# EAGLE schematic eagle_export_sch (EAGLE 7.5.0)

## Sheet 1 of 4
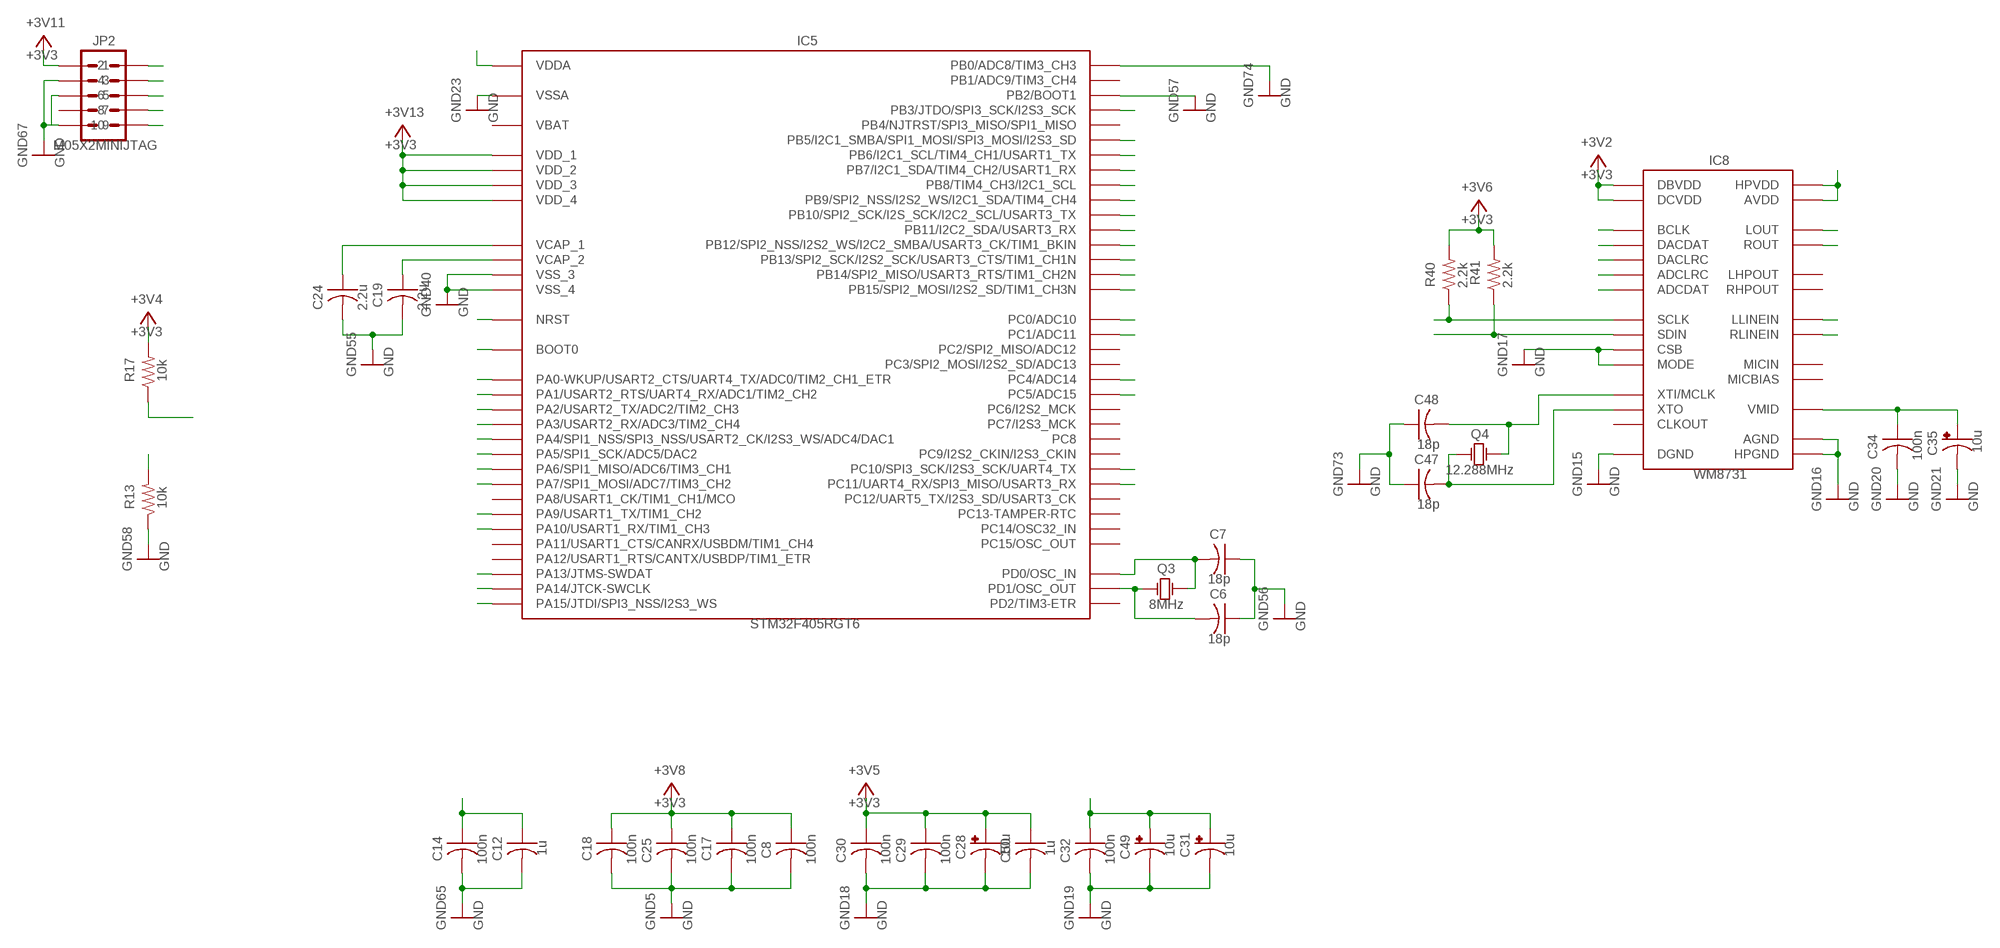
[diagram p0: schematic, sheet 1]

### Parts
C6  18p  C-USC0603_2  [CAP_0603]
C7  18p  C-USC0603_2  [CAP_0603]
C8  100n  C-USC0603  [CAP_0603]
C12  1u  C-USC0603  [CAP_0603]
C14  100n  C-USC0603  [CAP_0603]
C17  100n  C-USC0603  [CAP_0603]
C18  100n  C-USC0603  [CAP_0603]
C19  2.2u  C-USC0805  [CAP_0805]
C24  2.2u  C-USC0805  [CAP_0805]
C25  100n  C-USC0603  [CAP_0603]
C28  10u  CPOL-USA  [PANASONIC_A]
C29  100n  C-USC0603  [CAP_0603]
C30  100n  C-USC0603  [CAP_0603]
C31  10u  CPOL-USB  [PANASONIC_B]
C32  100n  C-USC0603  [CAP_0603]
C34  100n  C-USC0603  [CAP_0603]
C35  10u  CPOL-USB  [PANASONIC_B]
C47  18p  C-USC0603_3  [CAP_0603]
C48  18p  C-USC0603_3  [CAP_0603]
C49  10u  CPOL-USA  [PANASONIC_A]
C50  1u  C-USC0603  [CAP_0603]
IC5  STM32F405RGT6  STM32F20X  [TQFP-10X10-64]
IC8  WM8731  [SSOP28]
JP2  M05X2MINIJTAG  [2X5-1.27]
Q3  8MHz  TXC_7A_CRYSTAL  [TSC_7A_crystal]
Q4  12.288MHz  TXC_7A_CRYSTAL  [TSC_7A_crystal]
R13  10k  R-US_R0603_26  [RES_0603]
R17  10k  R-US_R0603_27  [RES_0603]
R40  2.2k  R-US_R0603_27  [RES_0603]
R41  2.2k  R-US_R0603_27  [RES_0603]

### Nets
+3V3: C8.1 C17.1 C18.1 C25.1 C28.+ C29.1 C30.1 C50.1 IC5.19(VDD_4) IC5.32(VDD_1) IC5.48(VDD_2) IC5.64(VDD_3) IC8.1(DBVDD) IC8.27(DCVDD) JP2.1 R17.2 R40.2 R41.2 ; also sheet 3,4
+3V3_A: C12.1 C14.1 C31.+ C32.1 C49.+ IC5.13(VDDA) IC8.8(HPVDD) IC8.14(AVDD) ; also sheet 2,3,4
Blend2: IC5.10(PC2/SPI2_MISO/ADC12) ; also sheet 2
Blend3: IC5.11(PC3/SPI2_MOSI/I2S2_SD/ADC13) ; also sheet 2
Blend4: IC5.27(PB1/ADC9/TIM3_CH4) ; also sheet 2
BLEND_CV: IC5.21(PA5/SPI1_SCK/ADC5/DAC2) ; also sheet 2
BLEND_POT: IC5.23(PA7/SPI1_MOSI/ADC7/TIM3_CH2) ; also sheet 3
BOOT_FLASH: IC5.60(BOOT0) R13.2
DENSITY_CV: IC5.17(PA3/USART2_RX/ADC3/TIM2_CH4) ; also sheet 2
GND: C6.1 C7.1 C8.2 C12.2 C14.2 C17.2 C18.2 C19.2 C24.2 C25.2 C28.- C29.2 C30.2 C31.- C32.2 C34.2 C35.- C47.1 C48.1 C49.- C50.2 IC5.12(VSSA) IC5.18(VSS_4) IC5.26(PB0/ADC8/TIM3_CH3) IC5.28(PB2/BOOT1) IC5.63(VSS_3) IC8.11(HPGND) IC8.15(AGND) IC8.21(MODE) IC8.22(CSB) IC8.28(DGND) JP2.3 JP2.5 JP2.9 R13.1 ; also sheet 2,3,4
I2C_SCL: IC5.29(PB10/SPI2_SCK/I2S_SCK/I2C2_SCL/USART3_TX) IC8.24(SCLK) R40.1
I2C_SDA: IC5.30(PB11/I2C2_SDA/USART3_RX) IC8.23(SDIN) R41.1
I2S_LRCK: IC5.33(PB12/SPI2_NSS/I2S2_WS/I2C2_SMBA/USART3_CK/TIM1_BKIN) IC8.5(DACLRC) IC8.7(ADCLRC)
I2S_SCK: IC5.34(PB13/SPI2_SCK/I2S2_SCK/USART3_CTS/TIM1_CH1N) IC8.3(BCLK)
I2S_SIN: IC5.35(PB14/SPI2_MISO/USART3_RTS/TIM1_CH2N) IC8.6(ADCDAT)
I2S_SOUT: IC5.36(PB15/SPI2_MOSI/I2S2_SD/TIM1_CH3N) IC8.4(DACDAT)
JTCK: IC5.49(PA14/JTCK-SWCLK) JP2.4
JTDI: IC5.50(PA15/JTDI/SPI3_NSS/I2S3_WS) JP2.8
JTDO: IC5.55(PB3/JTDO/SPI3_SCK/I2S3_SCK) JP2.6
JTMS: IC5.46(PA13/JTMS-SWDAT) JP2.2
LED_DATA: IC5.57(PB5/I2C1_SMBA/SPI1_MOSI/SPI3_MOSI/I2S3_SD) ; also sheet 3
LED_EN: IC5.24(PC4/ADC14) ; also sheet 3
LED_REC: IC5.62(PB9/SPI2_NSS/I2S2_WS/I2C1_SDA/TIM4_CH4) ; also sheet 3
LED_SCK: IC5.25(PC5/ADC15) ; also sheet 3
LIN: IC8.20(LLINEIN) ; also sheet 2
LOUT: IC8.12(LOUT) ; also sheet 2
N$7: C7.2 IC5.5(PD0/OSC_IN) Q3.2(OSC2)
N$8: C6.2 IC5.6(PD1/OSC_OUT) Q3.1(OSC1)
N$13: C19.1 IC5.47(VCAP_2)
N$17: C34.1 C35.+ IC8.16(VMID)
N$19: C24.1 IC5.31(VCAP_1)
N$59: C47.2 IC8.26(XTO) Q4.1(OSC1)
N$60: C48.2 IC8.25(XTI/MCLK) Q4.2(OSC2)
PITCH_POT: IC5.9(PC1/ADC11) ; also sheet 3
PLAY: IC5.58(PB6/I2C1_SCL/TIM4_CH1/USART1_TX) ; also sheet 3
POSITION_POT_CV: IC5.16(PA2/USART2_TX/ADC2/TIM2_CH3) ; also sheet 2
REC: IC5.59(PB7/I2C1_SDA/TIM4_CH2/USART1_RX) ; also sheet 3
RESET: IC5.7(NRST) JP2.10 R17.1
RIN: IC8.19(RLINEIN) ; also sheet 2
ROUT: IC8.13(ROUT) ; also sheet 2
RX: IC5.43(PA10/USART1_RX/TIM1_CH3)
SIZE_CV: IC5.15(PA1/USART2_RTS/UART4_RX/ADC1/TIM2_CH2) ; also sheet 2
SIZE_POT: IC5.8(PC0/ADC10) ; also sheet 3
SW_LOAD: IC5.51(PC10/SPI3_SCK/I2S3_SCK/UART4_TX) ; also sheet 3
SW_MODE: IC5.52(PC11/UART4_RX/SPI3_MISO/USART3_RX) ; also sheet 3
SW_REC: IC5.61(PB8/TIM4_CH3/I2C1_SCL) ; also sheet 3
TEXTURE_CV: IC5.14(PA0-WKUP/USART2_CTS/UART4_TX/ADC0/TIM2_CH1_ETR) ; also sheet 2
TEXTURE_POT: IC5.22(PA6/SPI1_MISO/ADC6/TIM3_CH1) ; also sheet 3
TX: IC5.42(PA9/USART1_TX/TIM1_CH2)
V_OCT: IC5.20(PA4/SPI1_NSS/SPI3_NSS/USART2_CK/I2S3_WS/ADC4/DAC1) ; also sheet 2
Unconnected: IC5.2(PC13-TAMPER-RTC) IC5.3(PC14/OSC32_IN) IC5.4(PC15/OSC_OUT) IC5.37(PC6/I2S2_MCK) IC5.38(PC7/I2S3_MCK) IC5.39(PC8) IC5.40(PC9/I2S2_CKIN/I2S3_CKIN) IC5.41(PA8/USART1_CK/TIM1_CH1/MCO) IC5.44(PA11/USART1_CTS/CANRX/USBDM/TIM1_CH4) IC5.45(PA12/USART1_RTS/CANTX/USBDP/TIM1_ETR) IC5.53(PC12/UART5_TX/I2S3_SD/USART3_CK) IC5.54(PD2/TIM3-ETR) IC5.56(PB4/NJTRST/SPI3_MISO/SPI1_MISO) IC8.2(CLKOUT) IC8.9(LHPOUT) IC8.10(RHPOUT) IC8.17(MICBIAS) IC8.18(MICIN) JP2.7

## Sheet 2 of 4
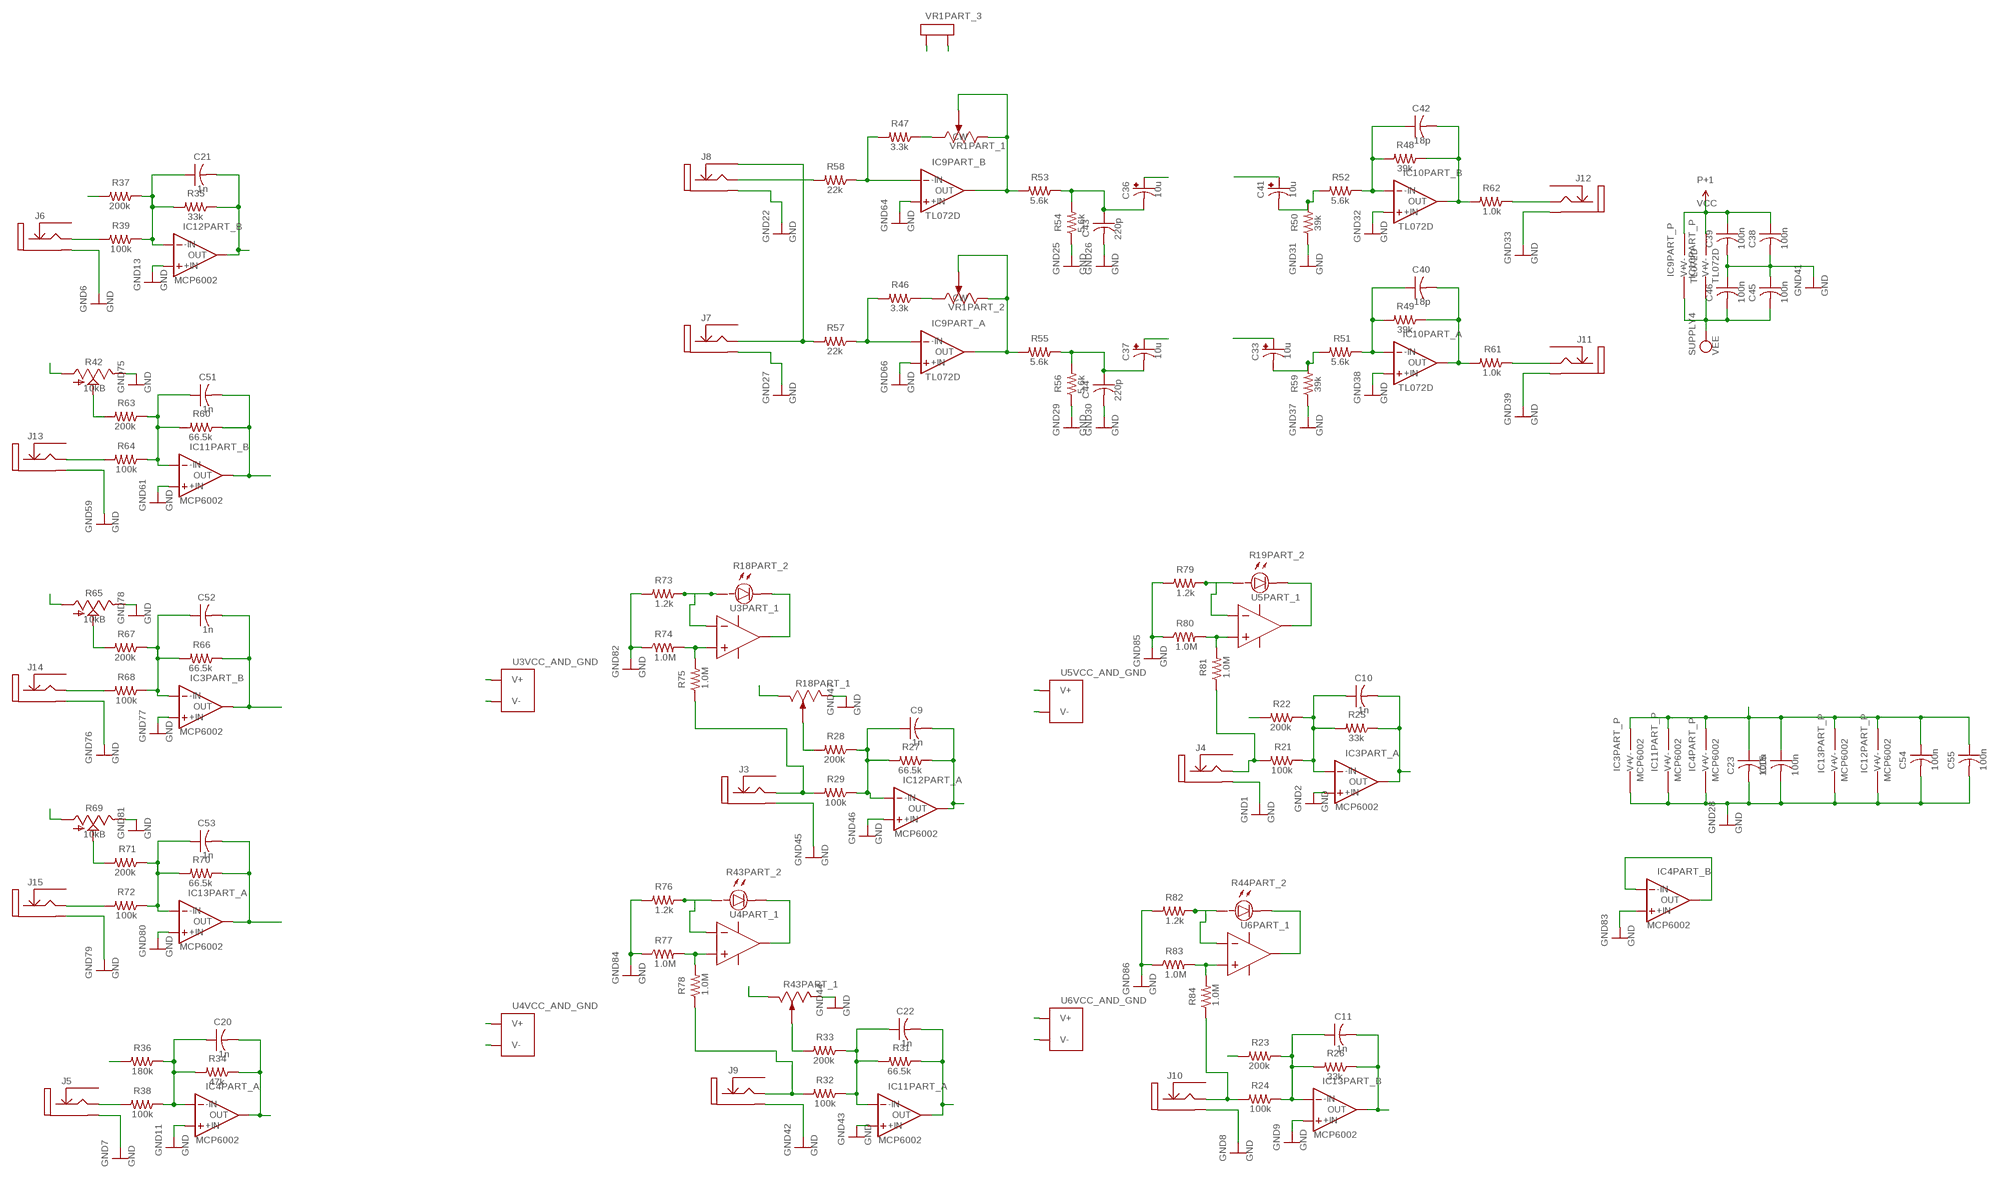
[diagram p1: schematic, sheet 2]

### Parts
C9  1n  C-USC0603_3  [CAP_0603]
C10  1n  C-USC0603_3  [CAP_0603]
C11  1n  C-USC0603_3  [CAP_0603]
C15  100n  C-USC0603  [CAP_0603]
C20  1n  C-USC0603_3  [CAP_0603]
C21  1n  C-USC0603_3  [CAP_0603]
C22  1n  C-USC0603_3  [CAP_0603]
C23  100n  C-USC0603  [CAP_0603]
C33  10u  CPOL-USA  [PANASONIC_A]
C36  10u  CPOL-USA  [PANASONIC_A]
C37  10u  CPOL-USA  [PANASONIC_A]
C38  100n  C-USC0603  [CAP_0603]
C39  100n  C-USC0603  [CAP_0603]
C40  18p  C-USC0603_3  [CAP_0603]
C41  10u  CPOL-USA  [PANASONIC_A]
C42  18p  C-USC0603_3  [CAP_0603]
C43  220p  C-USC0603  [CAP_0603]
C44  220p  C-USC0603  [CAP_0603]
C45  100n  C-USC0603  [CAP_0603]
C46  100n  C-USC0603  [CAP_0603]
C51  1n  C-USC0603_3  [CAP_0603]
C52  1n  C-USC0603_3  [CAP_0603]
C53  1n  C-USC0603_3  [CAP_0603]
C54  100n  C-USC0603  [CAP_0603]
C55  100n  C-USC0603  [CAP_0603]
IC3  MCP6002  TL072D  [SOIC-8/150mil]
IC4  MCP6002  TL072D  [SOIC-8/150mil]
IC9  TL072D  [SOIC-8/150mil]
IC10  TL072D  [SOIC-8/150mil]
IC11  MCP6002  TL072D  [SOIC-8/150mil]
IC12  MCP6002  TL072D  [SOIC-8/150mil]
IC13  MCP6002  TL072D  [SOIC-8/150mil]
J3  THONKICONN  [Thonkiconn_Jack]
J4  THONKICONN  [Thonkiconn_Jack]
J5  THONKICONN  [Thonkiconn_Jack]
J6  THONKICONN  [Thonkiconn_Jack]
J7  THONKICONN  [Thonkiconn_Jack]
J8  THONKICONN  [Thonkiconn_Jack]
J9  THONKICONN  [Thonkiconn_Jack]
J10  THONKICONN  [Thonkiconn_Jack]
J11  THONKICONN_33  [Thonkiconn_Jack]
J12  THONKICONN_33  [Thonkiconn_Jack]
J13  THONKICONN  [Thonkiconn_Jack]
J14  THONKICONN  [Thonkiconn_Jack]
J15  THONKICONN  [Thonkiconn_Jack]
R18  BOURNS_PTL_LED_SLIDE_POT  [BOURNS_PTL_30mm]
R19  BOURNS_PTL_LED_SLIDE_POT  [BOURNS_PTL_30mm]
R21  100k  R-US_R0603_25  [RES_0603]
R22  200k  R-US_R0603_25  [RES_0603]
R23  200k  R-US_R0603_25  [RES_0603]
R24  100k  R-US_R0603_25  [RES_0603]
R25  33k  R-US_R0603_25  [RES_0603]
R26  33k  R-US_R0603_25  [RES_0603]
R27  66.5k  R-US_R0603_25  [RES_0603]
R28  200k  R-US_R0603_25  [RES_0603]
R29  100k  R-US_R0603_25  [RES_0603]
R31  66.5k  R-US_R0603_25  [RES_0603]
R32  100k  R-US_R0603_25  [RES_0603]
R33  200k  R-US_R0603_25  [RES_0603]
R34  47k  R-US_R0603_25  [RES_0603]
R35  33k  R-US_R0603_25  [RES_0603]
R36  180k  R-US_R0603_25  [RES_0603]
R37  200k  R-US_R0603_25  [RES_0603]
R38  100k  R-US_R0603_25  [RES_0603]
R39  100k  R-US_R0603_25  [RES_0603]
R42  10kB  POT_USVERTICAL_PS_18  [ALPS_POT_VERTICAL_PS]
R43  BOURNS_PTL_LED_SLIDE_POT  [BOURNS_PTL_30mm]
R44  BOURNS_PTL_LED_SLIDE_POT  [BOURNS_PTL_30mm]
R46  3.3k  R-US_R0603_25  [RES_0603]
R47  3.3k  R-US_R0603_25  [RES_0603]
R48  39k  R-US_R0603_25  [RES_0603]
R49  39k  R-US_R0603_25  [RES_0603]
R50  39k  R-US_R0603_27  [RES_0603]
R51  5.6k  R-US_R0603_25  [RES_0603]
R52  5.6k  R-US_R0603_25  [RES_0603]
R53  5.6k  R-US_R0603_25  [RES_0603]
R54  5.6k  R-US_R0603_27  [RES_0603]
R55  5.6k  R-US_R0603_25  [RES_0603]
R56  5.6k  R-US_R0603_27  [RES_0603]
R57  22k  R-US_R0603_25  [RES_0603]
R58  22k  R-US_R0603_25  [RES_0603]
R59  39k  R-US_R0603_27  [RES_0603]
R60  66.5k  R-US_R0603_25  [RES_0603]
R61  1.0k  R-US_R0603_25  [RES_0603]
R62  1.0k  R-US_R0603_25  [RES_0603]
R63  200k  R-US_R0603_25  [RES_0603]
R64  100k  R-US_R0603_25  [RES_0603]
R65  10kB  POT_USVERTICAL_PS_18  [ALPS_POT_VERTICAL_PS]
R66  66.5k  R-US_R0603_25  [RES_0603]
R67  200k  R-US_R0603_25  [RES_0603]
R68  100k  R-US_R0603_25  [RES_0603]
R69  10kB  POT_USVERTICAL_PS_18  [ALPS_POT_VERTICAL_PS]
R70  66.5k  R-US_R0603_25  [RES_0603]
R71  200k  R-US_R0603_25  [RES_0603]
R72  100k  R-US_R0603_25  [RES_0603]
R73  1.2k  805  [RES_0603]
R74  1.0M  805_30  [RES_0603]
R75  1.0M  805_31  [RES_0603]
R76  1.2k  805  [RES_0603]
R77  1.0M  805_30  [RES_0603]
R78  1.0M  805_31  [RES_0603]
R79  1.2k  805  [RES_0603]
R80  1.0M  805_30  [RES_0603]
R81  1.0M  805_31  [RES_0603]
R82  1.2k  805  [RES_0603]
R83  1.0M  805_30  [RES_0603]
R84  1.0M  805_31  [RES_0603]
U3  LM321MF  [SOT23-5]
U4  LM321MF  [SOT23-5]
U5  LM321MF  [SOT23-5]
U6  LM321MF  [SOT23-5]
VR1  ALPS_DUAL_POT_9MM  [ALPS_dual_pot]

### Nets
+3V3_A: C15.1 C23.1 C54.1 C55.1 IC3.8(PART_P:V+) IC4.8(PART_P:V+) IC11.8(PART_P:V+) IC12.8(PART_P:V+) IC13.8(PART_P:V+) ; also sheet 1,3,4
AREF_-10: R18.1(PART_1:CCW) R22.2 R23.2 R36.2 R37.2 R42.P$3(A) R43.1(PART_1:CCW) R65.P$3(A) R69.P$3(A) ; also sheet 4
Blend2: C51.2 IC11.7(PART_B:OUT) R60.1 ; also sheet 1
Blend3: C52.2 IC3.7(PART_B:OUT) R66.1 ; also sheet 1
Blend4: C53.2 IC13.1(PART_A:OUT) R70.1 ; also sheet 1
BLEND_CV: C21.2 IC12.7(PART_B:OUT) R35.1 ; also sheet 1
DENSITY_CV: C22.2 IC11.1(PART_A:OUT) R31.1 ; also sheet 1
GND: C15.2 C23.2 C38.2 C39.2 C43.2 C44.2 C45.1 C46.1 C54.2 C55.2 IC3.3(PART_A:+IN) IC3.4(PART_P:V-) IC3.5(PART_B:+IN) IC4.3(PART_A:+IN) IC4.4(PART_P:V-) IC4.5(PART_B:+IN) IC9.3(PART_A:+IN) IC9.5(PART_B:+IN) IC10.3(PART_A:+IN) IC10.5(PART_B:+IN) IC11.3(PART_A:+IN) IC11.4(PART_P:V-) IC11.5(PART_B:+IN) IC12.3(PART_A:+IN) IC12.4(PART_P:V-) IC12.5(PART_B:+IN) IC13.3(PART_A:+IN) IC13.4(PART_P:V-) IC13.5(PART_B:+IN) J3.3(GND) J4.3(GND) J5.3(GND) J6.3(GND) J7.3(GND) J8.3(GND) J9.3(GND) J10.3(GND) J11.3(GND) J12.3(GND) J13.3(GND) J14.3(GND) J15.3(GND) R18.3(PART_1:CW) R42.P$1(E) R43.3(PART_1:CW) R50.1 R54.1 R56.1 R59.1 R65.P$1(E) R69.P$1(E) R73.2 R74.1 R76.2 R77.1 R79.2 R80.1 R82.2 R83.1 VR1.7(PART_3:gnd) VR1.8(PART_3:gnd) ; also sheet 1,3,4
LIN: C37.+ ; also sheet 1
LOUT: C33.+ ; also sheet 1
N$2: C10.1 IC3.2(PART_A:-IN) R21.1 R22.1 R25.2
N$5: C11.1 IC13.6(PART_B:-IN) R23.1 R24.1 R26.2
N$11: C20.1 IC4.2(PART_A:-IN) R34.2 R36.1 R38.1
N$15: C21.1 IC12.6(PART_B:-IN) R35.2 R37.1 R39.1
N$18: C37.- C44.1 R55.1 R56.2
N$20: J8.2(Tip) R58.2
N$21: J7.2(Tip) J8.1(TN) R57.2
N$22: C36.- C43.1 R53.1 R54.2
N$23: C41.- R50.2 R52.2
N$24: C22.1 IC11.2(PART_A:-IN) R31.2 R32.1 R33.1
N$25: C42.1 IC10.6(PART_B:-IN) R48.2 R52.1
N$26: R33.2 R43.2(PART_1:W)
N$28: C42.2 IC10.7(PART_B:OUT) R48.1 R62.2
N$30: C9.1 IC12.2(PART_A:-IN) R27.2 R28.1 R29.1
N$31: C33.- R51.2 R59.2
N$32: C40.1 IC10.2(PART_A:-IN) R49.2 R51.1
N$33: C40.2 IC10.1(PART_A:OUT) R49.1 R61.2
N$35: R18.2(PART_1:W) R28.2
N$42: IC9.7(PART_B:OUT) R53.2 VR1.2(PART_1:W) VR1.3(PART_1:CW)
N$51: IC9.1(PART_A:OUT) R55.2 VR1.5(PART_2:W) VR1.6(PART_2:CW)
N$54: IC9.6(PART_B:-IN) R47.2 R58.1
N$58: IC9.2(PART_A:-IN) R46.2 R57.1
Net_0: J13.2(Tip) R64.2
Net_1: J14.2(Tip) R68.2
Net_2: J15.2(Tip) R72.2
Net_3: R43.6(PART_2:gnd) U4.4(PART_1:OUT)
Net_4: R43.5(PART_2:gnd) R76.1 U4.3(PART_1:IN-)
Net_5: R77.2 R78.2 U4.1(PART_1:IN+)
Net_6: R18.6(PART_2:gnd) U3.4(PART_1:OUT)
Net_7: R18.5(PART_2:gnd) R73.1 U3.3(PART_1:IN-)
Net_8: R19.6(PART_2:gnd) U5.4(PART_1:OUT)
Net_9: R19.5(PART_2:gnd) R79.1 U5.3(PART_1:IN-)
Net_10: R80.2 R81.2 U5.1(PART_1:IN+)
Net_11: R44.6(PART_2:gnd) U6.4(PART_1:OUT)
Net_12: R44.5(PART_2:gnd) R82.1 U6.3(PART_1:IN-)
Net_13: R83.2 R84.2 U6.1(PART_1:IN+)
Net_24: J12.2(Tip) R62.1
Net_26: J9.2(Tip) R32.2 R78.1
Net_28: J5.2(Tip) R38.2
Net_32: J6.2(Tip) R39.2
Net_36: J10.2(Tip) R24.2 R84.1
Net_46: R74.2 R75.2 U3.1(PART_1:IN+)
Net_50: J3.2(Tip) R29.2 R75.1
Net_75: R47.1 VR1.1(PART_1:CCW)
Net_76: R46.1 VR1.4(PART_2:CCW)
Net_92: J11.2(Tip) R61.1
Net_105: J4.2(Tip) R21.2 R81.1
Net_106: C52.1 IC3.6(PART_B:-IN) R66.2 R67.1 R68.1
Net_107: C51.1 IC11.6(PART_B:-IN) R60.2 R63.1 R64.1
Net_114: R42.P$2(S) R63.2
Net_115: R65.P$2(S) R67.2
Net_116: R69.P$2(S) R71.2
Net_117: C53.1 IC13.2(PART_A:-IN) R70.2 R71.1 R72.1
Net_118: IC4.6(PART_B:-IN) IC4.7(PART_B:OUT)
POSITION_POT_CV: C9.2 IC12.1(PART_A:OUT) R27.1 ; also sheet 1
RIN: C36.+ ; also sheet 1
ROUT: C41.+ ; also sheet 1
SIZE_CV: C10.2 IC3.1(PART_A:OUT) R25.1 ; also sheet 1
TEXTURE_CV: C11.2 IC13.7(PART_B:OUT) R26.1 ; also sheet 1
V_OCT: C20.2 IC4.1(PART_A:OUT) R34.1 ; also sheet 1
VCC: C38.1 C39.1 IC9.8(PART_P:V+) IC10.8(PART_P:V+) U3.5(VCC_AND_GND:V+) U4.5(VCC_AND_GND:V+) U5.5(VCC_AND_GND:V+) U6.5(VCC_AND_GND:V+) ; also sheet 4
VEE: C45.2 C46.2 IC9.4(PART_P:V-) IC10.4(PART_P:V-) U3.2(VCC_AND_GND:V-) U4.2(VCC_AND_GND:V-) U5.2(VCC_AND_GND:V-) U6.2(VCC_AND_GND:V-) ; also sheet 4
Unconnected: J3.1(TN) J4.1(TN) J5.1(TN) J6.1(TN) J7.1(TN) J9.1(TN) J10.1(TN) J11.1(TN) J12.1(TN) J13.1(TN) J14.1(TN) J15.1(TN)

## Sheet 3 of 4
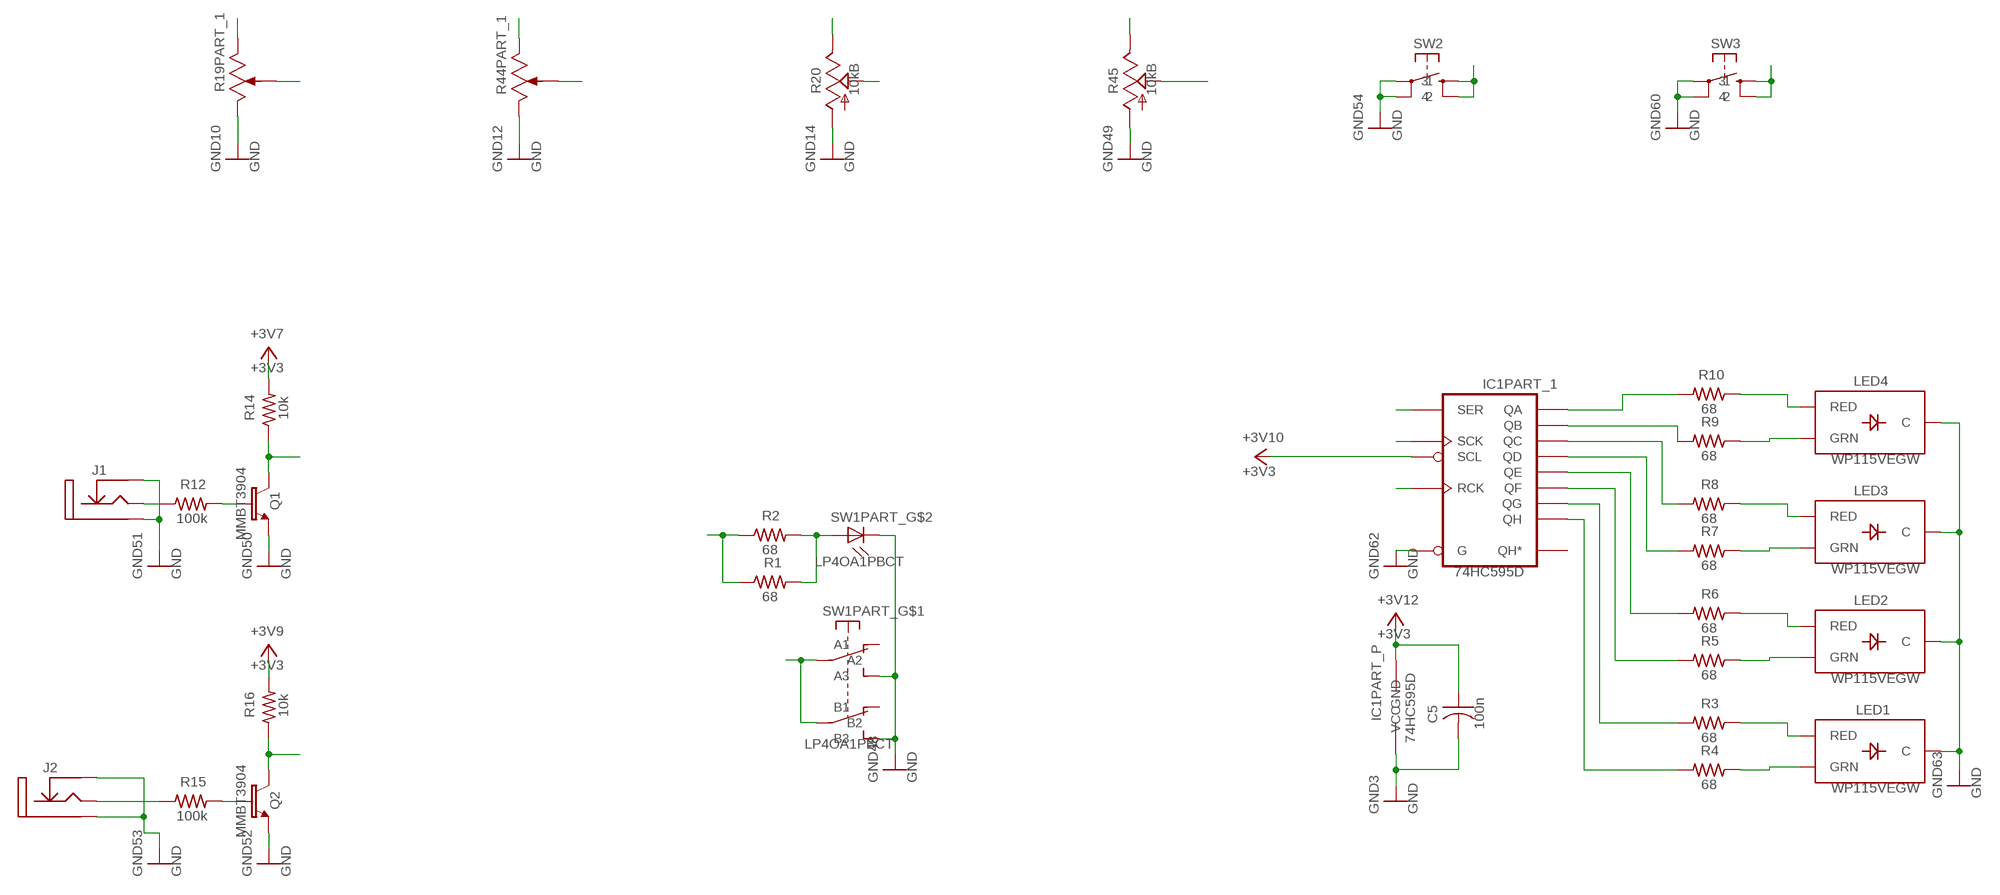
[diagram p2: schematic, sheet 3]

### Parts
C5  100n  C-USC0603  [CAP_0603]
IC1  74HC595D  [SO16]
J1  THONKICONN  [Thonkiconn_Jack]
J2  THONKICONN  [Thonkiconn_Jack]
LED1  WP115VEGW  LED-BICOLOR-THROUGHHOLE  [LED-BICOLOR-THROUGHHOLE]
LED2  WP115VEGW  LED-BICOLOR-THROUGHHOLE  [LED-BICOLOR-THROUGHHOLE]
LED3  WP115VEGW  LED-BICOLOR-THROUGHHOLE  [LED-BICOLOR-THROUGHHOLE]
LED4  WP115VEGW  LED-BICOLOR-THROUGHHOLE  [LED-BICOLOR-THROUGHHOLE]
Q1  MMBT3904  MMBT3904LT1-NPN-SOT23-BEC  [SOT23-BEC]
Q2  MMBT3904  MMBT3904LT1-NPN-SOT23-BEC  [SOT23-BEC]
R1  68  R-US_R0603  [RES_0603]
R2  68  R-US_R0603  [RES_0603]
R3  68  R-US_R0603_25  [RES_0603]
R4  68  R-US_R0603_25  [RES_0603]
R5  68  R-US_R0603_25  [RES_0603]
R6  68  R-US_R0603_25  [RES_0603]
R7  68  R-US_R0603_25  [RES_0603]
R8  68  R-US_R0603_25  [RES_0603]
R9  68  R-US_R0603_25  [RES_0603]
R10  68  R-US_R0603_25  [RES_0603]
R12  100k  R-US_R0603  [RES_0603]
R14  10k  R-US_R0603_27  [RES_0603]
R15  100k  R-US_R0603  [RES_0603]
R16  10k  R-US_R0603_27  [RES_0603]
R20  10kB  POT_USVERTICAL_PS  [ALPS_POT_VERTICAL_PS]
R45  10kB  POT_USVERTICAL_PS  [ALPS_POT_VERTICAL_PS]
SW1  LP4OA1PBCT  [LP4OA1PBCT]
SW2  TAC_SWITCHPTH  [TACTILE-PTH]
SW3  TAC_SWITCHPTH  [TACTILE-PTH]

### Nets
+3V3: C5.1 IC1.10(PART_1:SCL) IC1.16(PART_P:VCC) R14.2 R16.2 ; also sheet 1,4
+3V3_A: R19.3(PART_1:CW) R20.P$1(E) R44.3(PART_1:CW) R45.P$1(E) ; also sheet 1,2,4
BLEND_POT: R45.P$2(S) ; also sheet 1
GND: C5.2 IC1.8(PART_P:GND) IC1.13(PART_1:G) J1.1(TN) J1.3(GND) J2.1(TN) J2.3(GND) LED1.2(C) LED2.2(C) LED3.2(C) LED4.2(C) Q1.E Q2.E R19.1(PART_1:CCW) R20.P$3(A) R44.1(PART_1:CCW) R45.P$3(A) SW1.L2(PART_G$2:L2) SW1.P3(PART_G$1:A3) SW1.P6(PART_G$1:B3) SW2.1 SW2.2 SW3.1 SW3.2 ; also sheet 1,2,4
LED_DATA: IC1.14(PART_1:SER) ; also sheet 1
LED_EN: IC1.12(PART_1:RCK) ; also sheet 1
LED_REC: R1.1 R2.1 ; also sheet 1
LED_SCK: IC1.11(PART_1:SCK) ; also sheet 1
N$37: Q2.B R15.2
N$38: R1.2 R2.2 SW1.L1(PART_G$2:L1)
N$43: IC1.15(PART_1:QA) R10.2
N$44: IC1.1(PART_1:QB) R9.2
N$45: IC1.2(PART_1:QC) R8.2
N$46: IC1.3(PART_1:QD) R7.2
N$47: IC1.4(PART_1:QE) R6.2
N$48: IC1.5(PART_1:QF) R5.2
N$49: IC1.6(PART_1:QG) R3.2
N$50: IC1.7(PART_1:QH) R4.2
N$66: Q1.B R12.2
Net_31: LED4.3(RED) R10.1
Net_34: LED4.1(GRN) R9.1
Net_38: LED3.3(RED) R8.1
Net_51: LED3.1(GRN) R7.1
Net_56: LED2.3(RED) R6.1
Net_59: J2.2(Tip) R15.1
Net_61: LED2.1(GRN) R5.1
Net_62: LED1.3(RED) R3.1
Net_63: LED1.1(GRN) R4.1
Net_78: J1.2(Tip) R12.1
PITCH_POT: R20.P$2(S) ; also sheet 1
PLAY: Q2.C R16.1 ; also sheet 1
REC: Q1.C R14.1 ; also sheet 1
SIZE_POT: R19.2(PART_1:W) ; also sheet 1
SW_LOAD: SW3.3 SW3.4 ; also sheet 1
SW_MODE: SW2.3 SW2.4 ; also sheet 1
SW_REC: SW1.P2(PART_G$1:A2) SW1.P5(PART_G$1:B2) ; also sheet 1
TEXTURE_POT: R44.2(PART_1:W) ; also sheet 1
Unconnected: IC1.9(PART_1:QH*) SW1.P1(PART_G$1:A1) SW1.P4(PART_G$1:B1)

## Sheet 4 of 4
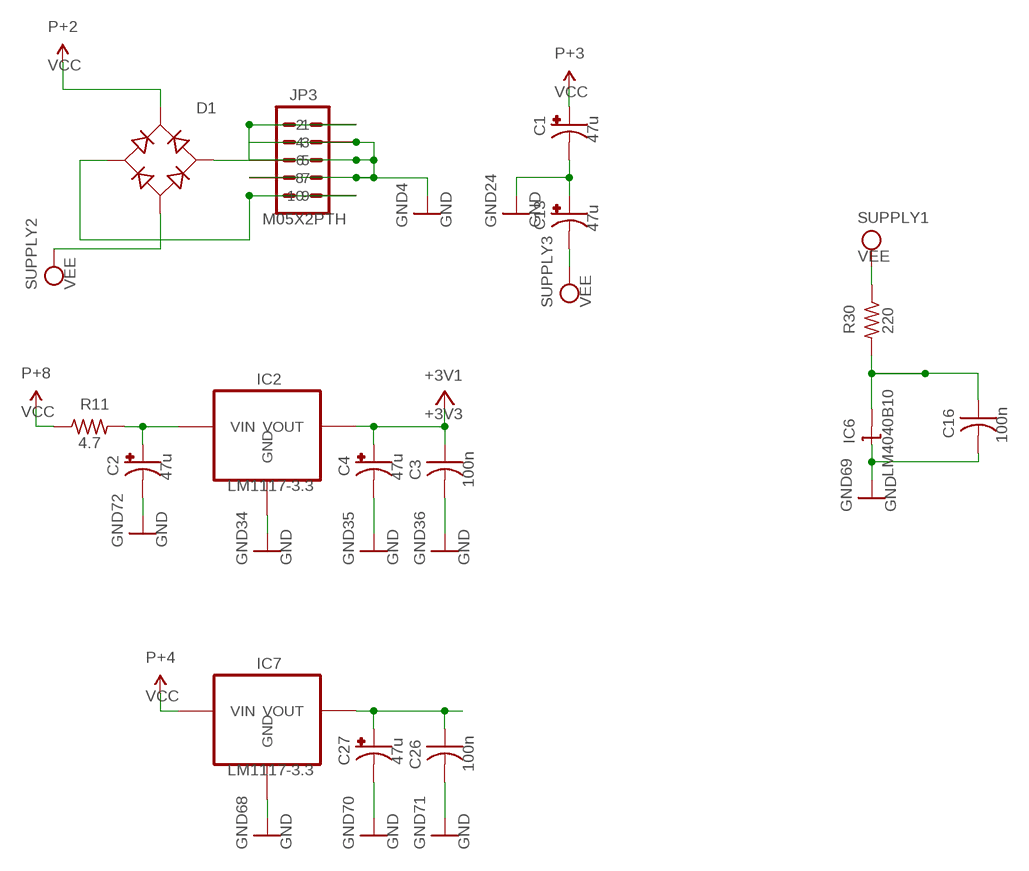
[diagram p3: schematic, sheet 4]

### Parts
C1  47u  667-EEE-FT1V470AR  [CAPAE-5.3x5.3h7]
C2  47u  667-EEE-FT1V470AR  [CAPAE-5.3x5.3h7]
C3  100n  C-USC0603  [CAP_0603]
C4  47u  667-EEE-FT1V470AR  [CAPAE-5.3x5.3h7]
C13  47u  667-EEE-FT1V470AR  [CAPAE-5.3x5.3h7]
C16  100n  C-USC0603  [CAP_0603]
C26  100n  C-USC0603  [CAP_0603]
C27  47u  667-EEE-FT1V470AR  [CAPAE-5.3x5.3h7]
D1  MB1S  [SOP-4/6.5x2.54]
IC2  LM1117-3.3  REG1117T  [SOT223-4]
IC6  LM4040B10  LM4041B12DBZ  [DBZ_R-PDSO-G3]
IC7  LM1117-3.3  REG1117  [SOT223]
JP3  M05X2PTH  [AVR_ICSP]
R11  4.7  R-US_R1206  [R1206]
R30  220  R-US_R0603_28  [RES_0603]

### Nets
+3V3: C3.1 C4.1(+) IC2.2(VOUT) IC2.4(VOUT) ; also sheet 1,3
+3V3_A: C26.1 C27.1(+) IC7.2(VOUT) IC7.4(VOUT) ; also sheet 1,2,3
AREF_-10: C16.1 IC6.2(A) R30.2 ; also sheet 2
GND: C1.2(-) C2.2(-) C3.2 C4.2(-) C13.1(+) C16.2 C26.2 C27.2(-) IC2.1(GND) IC6.1(C) IC7.1(GND) JP3.3 JP3.4 JP3.5 JP3.6 JP3.7 JP3.8 ; also sheet 1,2,3
N$55: C2.1(+) IC2.3(VIN) R11.2
N$56: D1.3(AC2) JP3.1 JP3.2
N$64: D1.4(AC1) JP3.9 JP3.10
VCC: C1.1(+) D1.1(+) IC7.3(VIN) R11.1 ; also sheet 2
VEE: C13.2(-) D1.2(-) R30.1 ; also sheet 2

## Power pins joined to a net without a drawn wire
VBAT: IC5.1(VBAT)

## Library data of the parts
C1 C2 C4 C13 C27 = common:667-EEE-FT1V470AR; MANUFACTURER: panasonic
C3 C5 C8 C14-C18 C23 C25 C26 C29 C30 C32 C34 C38 C39 C45 C46 C54 C55 = common:C-USC0603
C6 C7 = common:C-USC0603_2
C9-C11 C20-C22 C51-C53 = common:C-USC0603_3
C12 C43 C44 C50 = common:C-USC0603; VALUE: 100n
C19 C24 = common:C-USC0805
C28 C33 C36 C37 C41 C49 = common:CPOL-USA
C31 C35 = common:CPOL-USB
C40 C42 C47 C48 = common:C-USC0603_3; VALUE: 1n
D1 = common:MB1S
IC1 = common:74HC595D
IC2 = common:REG1117T
IC3 IC4 IC11-IC13 = common:TL072D
IC5 = common:STM32F20X
IC6 = common:LM4041B12DBZ
IC7 = common:REG1117
IC8 = common:WM8731
IC9 IC10 = common:TL072D; VALUE: MCP6002
J1-J10 J13-J15 = common:THONKICONN
J11 J12 = common:THONKICONN_33
JP2 = common:M05X2MINIJTAG
JP3 = common:M05X2PTH
LED1-LED4 = common:LED-BICOLOR-THROUGHHOLE
Q1 Q2 = common:MMBT3904LT1-NPN-SOT23-BEC
Q3 = common:TXC_7A_CRYSTAL; DATASHEET: http://datasheets.diptrace.com/crystals/12SMX.pdf
Q4 = common:TXC_7A_CRYSTAL; DATASHEET: http://datasheets.diptrace.com/crystals/12SMX.pdf; VALUE: 8MHz
R1 R2 = common:R-US_R0603
R3-R10 = common:R-US_R0603_25
R11 = common:R-US_R1206
R12 R15 = common:R-US_R0603; VALUE: 68
R13 = common:R-US_R0603_26
R14 R16 R17 = common:R-US_R0603_27
R18 R19 R43 R44 = common:BOURNS_PTL_LED_SLIDE_POT; DATASHEET: http://www.bourns.com/data/global/pdfs/bourns_trimpot_catalog.pdf; MANUFACTURER: Bourns
R20 R45 = common:POT_USVERTICAL_PS
R21-R29 R31-R39 R46-R49 R51-R53 R55 R57 R58 R60-R64 R66-R68 R70-R72 = common:R-US_R0603_25; VALUE: 68
R30 = common:R-US_R0603_28
R40 R41 R50 R54 R56 R59 = common:R-US_R0603_27; VALUE: 10k
R42 R65 R69 = common:POT_USVERTICAL_PS_18
R73 R76 R79 R82 = common:805
R74 R77 R80 R83 = common:805_30
R75 R78 R81 R84 = common:805_31
SW1 = common:LP4OA1PBCT
SW2 SW3 = common:TAC_SWITCHPTH
U3-U6 = common:LM321MF; DATASHEET: http://www.st.com/internet/com/TECHNICAL_RESOURCES/TECHNICAL_LITERATURE/DATASHEET/CD00000489.pdf
VR1 = common:ALPS_DUAL_POT_9MM